# EAGLE design ESP32 (EAGLE 7.0.0)
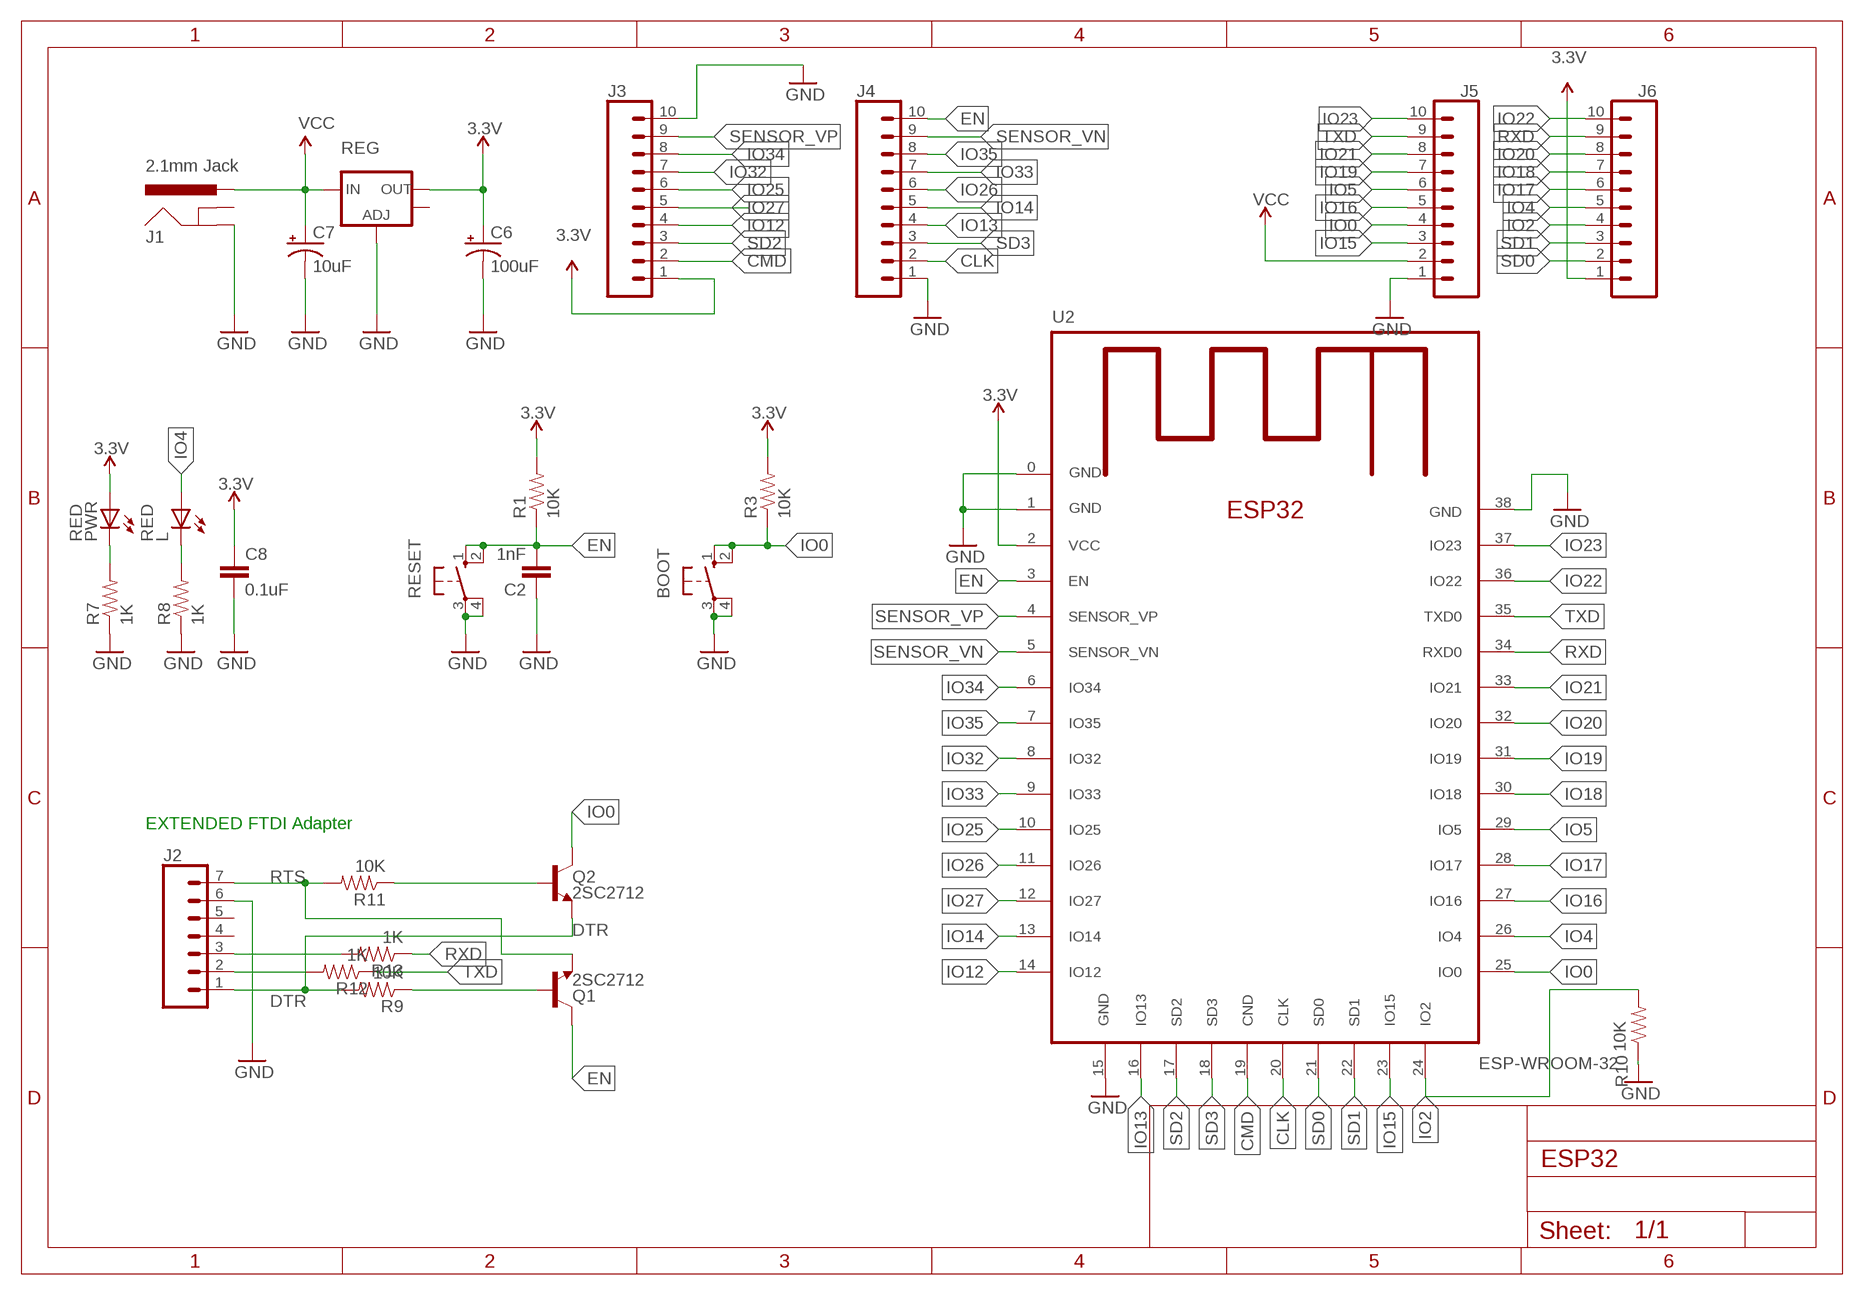
[diagram p0: schematic, sheet 1]

## Parts
BOOT  10-XX  [B3F-10XX]
C2  1nF  CAP0805  [0805]
C6  100uF  CAP_POLD  [PANASONIC_D]
C7  10uF  CAP_POLD  [PANASONIC_D]
C8  0.1uF  CAP0805  [0805]
J1  2.1mm Jack  POWER_JACKPTH_LOCK  [POWER_JACK_PTH_LOCK]
J2  CONN_07LOCK  [1X07_LOCK]
J3  CONN_10"  [1X10]
J4  CONN_10"  [1X10]
J5  CONN_10"  [1X10]
J6  CONN_10"  [1X10]
L  RED  LEDCHIP-LED0805  [CHIP-LED0805]
PWR  RED  LEDCHIP-LED0805  [CHIP-LED0805]
Q1  2SC2712  TRANS_NPN-MMBTA42  [SOT23-3]
Q2  2SC2712  TRANS_NPN-MMBTA42  [SOT23-3]
R1  10K  RESISTOR0805-RES  [0805]
R3  10K  RESISTOR0805-RES  [0805]
R7  1K  RESISTOR0805-RES  [0805]
R8  1K  RESISTOR0805-RES  [0805]
R9  10K  RESISTOR0805-RES  [0805]
R10  10K  RESISTOR0805-RES  [0805]
R11  10K  RESISTOR0805-RES  [0805]
R12  1K  RESISTOR0805-RES  [0805]
R13  1K  RESISTOR0805-RES  [0805]
REG  V_REG_LM1117SOT223  [SOT223]
RESET  10-XX  [B3F-10XX]
U2  ESP-WROOM-32  ESP32MOD  [ESP32MOD]

## Nets
3.3V [PWR]: C6.+ C8.1 J3.1 J6.1 PWR.A R1.2 R3.2 REG.2(OUT) U2.2(VCC)
B: Q2.1(B) R11.1
CLK: J4.2 U2.20(CLK)
CMD: J3.2 U2.19(CND)
DTR: J2.1 Q2.2(E) R9.2
EN: C2.2 J4.10 Q1.3(C) R1.1 RESET.1(S) RESET.2(S1) U2.3(EN)
GND [PWR]: BOOT.3(P) BOOT.4(P1) C2.1 C6.- C7.- C8.2 J1.GND J2.6 J3.10 J4.1 J5.1 R7.1 R8.1 R10.1 REG.1(ADJ) RESET.3(P) RESET.4(P1) U2.15(GND) U2.38(GND)
IO0: BOOT.1(S) BOOT.2(S1) J5.4 Q2.3(C) R3.1 U2.25(IO0)
IO2: J6.4 R10.2 U2.24(IO2)
IO4: J6.5 L.A U2.26(IO4)
IO5: J5.6 U2.29(IO5)
IO12: J3.4 U2.14(IO12)
IO13: J4.4 U2.16(IO13)
IO14: J4.5 U2.13(IO14)
IO15: J5.3 U2.23(IO15)
IO16: J5.5 U2.27(IO16)
IO17: J6.6 U2.28(IO17)
IO18: J6.7 U2.30(IO18)
IO19: J5.7 U2.31(IO19)
IO20: J6.8 U2.32(IO20)
IO21: J5.8 U2.33(IO21)
IO22: J6.10 U2.36(IO22)
IO23: J5.10 U2.37(IO23)
IO25: J3.6 U2.10(IO25)
IO26: J4.6 U2.11(IO26)
IO27: J3.5 U2.12(IO27)
IO32: J3.7 U2.8(IO32)
IO33: J4.7 U2.9(IO33)
IO34: J3.8 U2.6(IO34)
IO35: J4.8 U2.7(IO35)
N$1: J2.2 R12.2
N$2: J2.3 R13.2
N$3: Q1.1(B) R9.1
N$11 [PWR]: PWR.C R7.2
N$12 [PWR]: L.C R8.2
RTS: J2.7 Q1.2(E) R11.2
RXD: J6.9 R13.1 U2.34(RXD0)
SD0: J6.2 U2.21(SD0)
SD1: J6.3 U2.22(SD1)
SD2: J3.3 U2.17(SD2)
SD3: J4.3 U2.18(SD3)
SENSOR_VN: J4.9 U2.5(SENSOR_VN)
SENSOR_VP: J3.9 U2.4(SENSOR_VP)
TXD: J5.9 R12.1 U2.35(TXD0)
VCC [PWR]: C7.+ J1.PWR J5.2 REG.3(IN)
Unconnected: J1.GNDBREAK J2.4 J2.5 REG.4(OUT)

## Notes on the sheet
- EXTENDED FTDI Adapter

## Power pins joined to a net without a drawn wire
GND: U2.0(GND) U2.1(GND)

## Library data of the parts
BOOT RESET = ginger:10-XX: OMRON SWITCH
C2 C8 = SparkFun:CAP: Capacitor Standard 0603 ceramic capacitor, and 0.1" leaded capacitor.
C6 C7 = SparkFun:CAP_POL: Capacitor Polarized These are standard SMD and PTH capacitors. Normally 10uF, 47uF, and 100uF in electrolytic and tantalum varieties. Always verify the external diameter of the through hole cap, it varies with capacity, voltage, and manufacturer. The EIA devices should be standard.
J1 = SparkFun-Connectors:POWER_JACK: Power Jack This is the standard 5.5mm barrel jack for power. The PTH is the most common, proven, reliable, footprint. The Slot footprint only works if the mill layer is transmitted to the PCB fab house so be warned. Spark Fun Electronics SKU : PRT-00119 SMT: CONN-08106 Mating wall wart : TOL-00298 (and others)
J2 = SparkFun-Connectors:CONN_07: Multi connection point. Often used as Generic Header-pin footprint for 0.1 inch spaced/style header connections On any of the 0.1 inch spaced packages, you can populate with these: Break Away Headers - Straight <https://www.sparkfun.com/products/116> (PRT-00116) Break Away Male Headers - Right Angle <https://www.sparkfun.com/products/553> (PRT-00553) Female Headers <https://www.sparkfun.com/products/115> (PRT-00115) Break Away Headers - Machine Pin <https://www.sparkfun.com/products/117> (PRT-00117) Break Away Female Headers - Swiss Machine Pin <https://www.sparkfun.com/products/743> (PRT-00743) For SCREWTERMINALS and SPRING TERMINALS visit here: Screw Terimnals on SparkFun.com <https://www.sparkfun.com/search/results?term=Screw+Terminals> (5mm/3.5mm/2.54mm spacing) This device is also useful as a general connection point to wire up your design to another part of your project. Our various solder wires solder well into these plated through hole pads. Hook-Up Wire - Assortment (Stranded, 22 AWG) <https://www.sparkfun.com/products/11375> (PRT-11375) Hook-Up Wire - Assortment (Solid Core, 22 AWG) <https://www.sparkfun.com/products/11367> (PRT-11367) View the entire wire category on our website here <https://www.sparkfun.com/categories/141> Special notes: Molex polarized connector foot print use with SKU : PRT-08231 with associated crimp pins and housings. 1MM SMD Version SKU: PRT-10208 NOTES ON THE VARIANTS LOCK and LOCK_LONGPADS... This footprint was designed to help hold the alignment of a through-hole component (i.e. 6-pin header) while soldering it into place. You may notice that each hole has been shifted either up or down by 0.005 of an inch from it's more standard position (which is a perfectly straight line). This slight alteration caused the pins (the squares in the middle) to touch the edges of the holes. Because they are alternating, it causes a "brace" to hold the component in place. 0.005 has proven to be the perfect amount of "off-center" position when using our standard breakaway headers. Although looks a little odd when you look at the bare footprint, once you have a header in there, the alteration is very hard to notice. Also,if you push a header all the way into place, it is covered up entirely on the bottom side.
J3-J6 = SparkFun-Connectors:CONN_10: Multi connection point. Often used as Generic Header-pin footprint for 0.1 inch spaced/style header connections On any of the 0.1 inch spaced packages, you can populate with these: Break Away Headers - Straight <https://www.sparkfun.com/products/116> (PRT-00116) Break Away Male Headers - Right Angle <https://www.sparkfun.com/products/553> (PRT-00553) Female Headers <https://www.sparkfun.com/products/115> (PRT-00115) Break Away Headers - Machine Pin <https://www.sparkfun.com/products/117> (PRT-00117) Break Away Female Headers - Swiss Machine Pin <https://www.sparkfun.com/products/743> (PRT-00743) Arduino Stackable Header - 10 Pin <https://www.sparkfun.com/products/11376> (PRT-11376) For SCREWTERMINALS and SPRING TERMINALS visit here: Screw Terimnals on SparkFun.com <https://www.sparkfun.com/search/results?term=Screw+Terminals> (5mm/3.5mm/2.54mm spacing) This device is also useful as a general connection point to wire up your design to another part of your project. Our various solder wires solder well into these plated through hole pads. Hook-Up Wire - Assortment (Stranded, 22 AWG) <https://www.sparkfun.com/products/11375> (PRT-11375) Hook-Up Wire - Assortment (Solid Core, 22 AWG) <https://www.sparkfun.com/products/11367> (PRT-11367) View the entire wire category on our website here <https://www.sparkfun.com/categories/141> Special notes: Molex polarized connector foot print use with SKU : PRT-08231 with associated crimp pins and housings. 1MM SMD Version SKU: PRT-10208 NOTES ON THE VARIANTS LOCK and LOCK_LONGPADS... This footprint was designed to help hold the alignment of a through-hole component (i.e. 6-pin header) while soldering it into place. You may notice that each hole has been shifted either up or down by 0.005 of an inch from it's more standard position (which is a perfectly straight line). This slight alteration caused the pins (the squares in the middle) to touch the edges of the holes. Because they are alternating, it causes a "brace" to hold the component in place. 0.005 has proven to be the perfect amount of "off-center" position when using our standard breakaway headers. Although looks a little odd when you look at the bare footprint, once you have a header in there, the alteration is very hard to notice. Also,if you push a header all the way into place, it is covered up entirely on the bottom side.; PROD_ID: CONN-11563
L PWR = adafruit:LED: LED OSRAM: - CHIPLED LG R971, LG N971, LY N971, LG Q971, LY Q971, LO R971, LY R971 LH N974, LH R974 LS Q976, LO Q976, LY Q976 LO Q996 - Hyper CHIPLED LW Q18S LB Q993, LB Q99A, LB R99A - SideLED LS A670, LO A670, LY A670, LG A670, LP A670 LB A673, LV A673, LT A673, LW A673 LH A674 LY A675 LS A676, LA A676, LO A676, LY A676, LW A676 LS A679, LY A679, LG A679 - Hyper Micro SIDELED® LS Y876, LA Y876, LO Y876, LY Y876 LT Y87S - SmartLED LW L88C, LW L88S LB L89C, LB L89S, LG L890 LS L89K, LO L89K, LY L89K LS L896, LA L896, LO L896, LY L896 - TOPLED LS T670, LO T670, LY T670, LG T670, LP T670 LSG T670, LSP T670, LSY T670, LOP T670, LYG T670 LG T671, LOG T671, LSG T671 LB T673, LV T673, LT T673, LW T673 LH T674 LS T676, LA T676, LO T676, LY T676, LB T676, LH T676, LSB T676, LW T676 LB T67C, LV T67C, LT T67C, LS T67K, LO T67K, LY T67K, LW E67C LS E67B, LA E67B, LO E67B, LY E67B, LB E67C, LV E67C, LT E67C LW T67C LS T679, LY T679, LG T679 LS T770, LO T770, LY T770, LG T770, LP T770 LB T773, LV T773, LT T773, LW T773 LH T774 LS E675, LA E675, LY E675, LS T675 LS T776, LA T776, LO T776, LY T776, LB T776 LHGB T686 LT T68C, LB T68C - Hyper Mini TOPLED® LB M676 - Mini TOPLED Santana® LG M470 LS M47K, LO M47K, LY M47K Source: http://www.osram.convergy.de/
Q1 Q2 = SparkFun-DiscreteSemi:TRANS_NPN: NPN transistor Current controlled devices typically used to amplify current or used as a switch. BC547 - COM-08928 <http://www.sparkfun.com/products/8928> (TO-92 45V 100mA) (1.Collector 2.Base 3.Emitter) 2N3904 - COM-00521 <http://www.sparkfun.com/products/521> (TO-92 40V 200mA) (1.Emitter 2.Base 3.Collector) P2N2222A - COM-12852 <http://www.sparkfun.com/products/12852> (TO-92 40V 600mA) (1.Collector 2.Base 3.Emitter); PROD_ID: TRANS-09116; VALUE: 500mA/300V
R1 R3 R7-R13 = SparkFun:RESISTOR: Resistor Basic schematic elements and footprints for 0603, 1206, and PTH resistors.
REG = SparkFun-PowerIC:V_REG_LM1117: Voltage Regulator LM1117 Standard adjustable voltage regulator but in SMD form. Spark Fun Electronics SKU : COM-00595
U2 = ESP3x:ESP32MOD: ESP32 Module Espressif

## Net classes
0 default: width 0.254 mm
1 PWR: width 0.762 mm

## Board
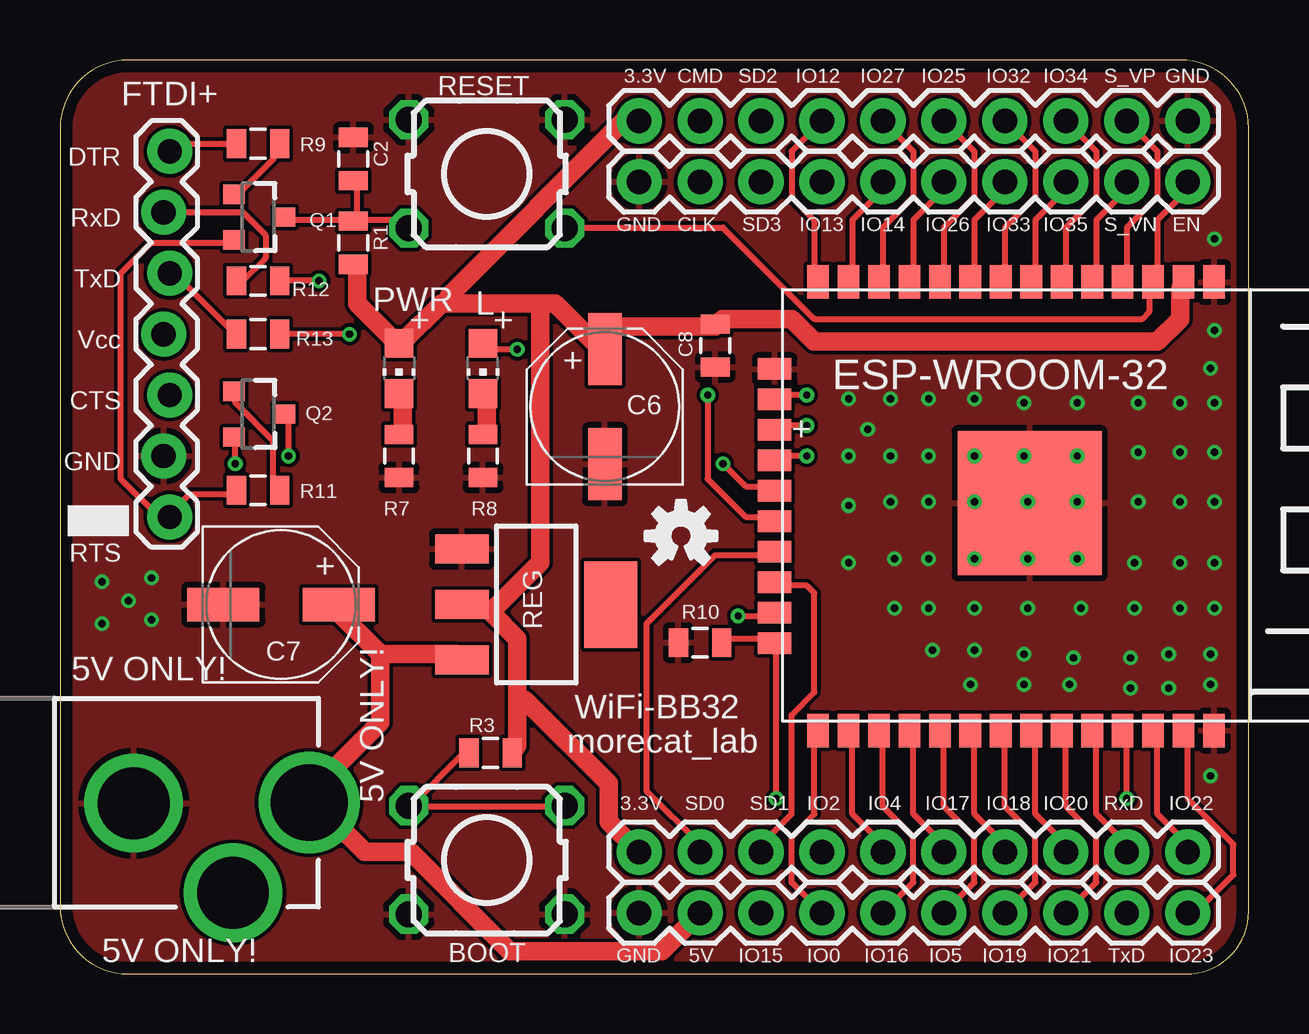
[diagram p1: board, top side]
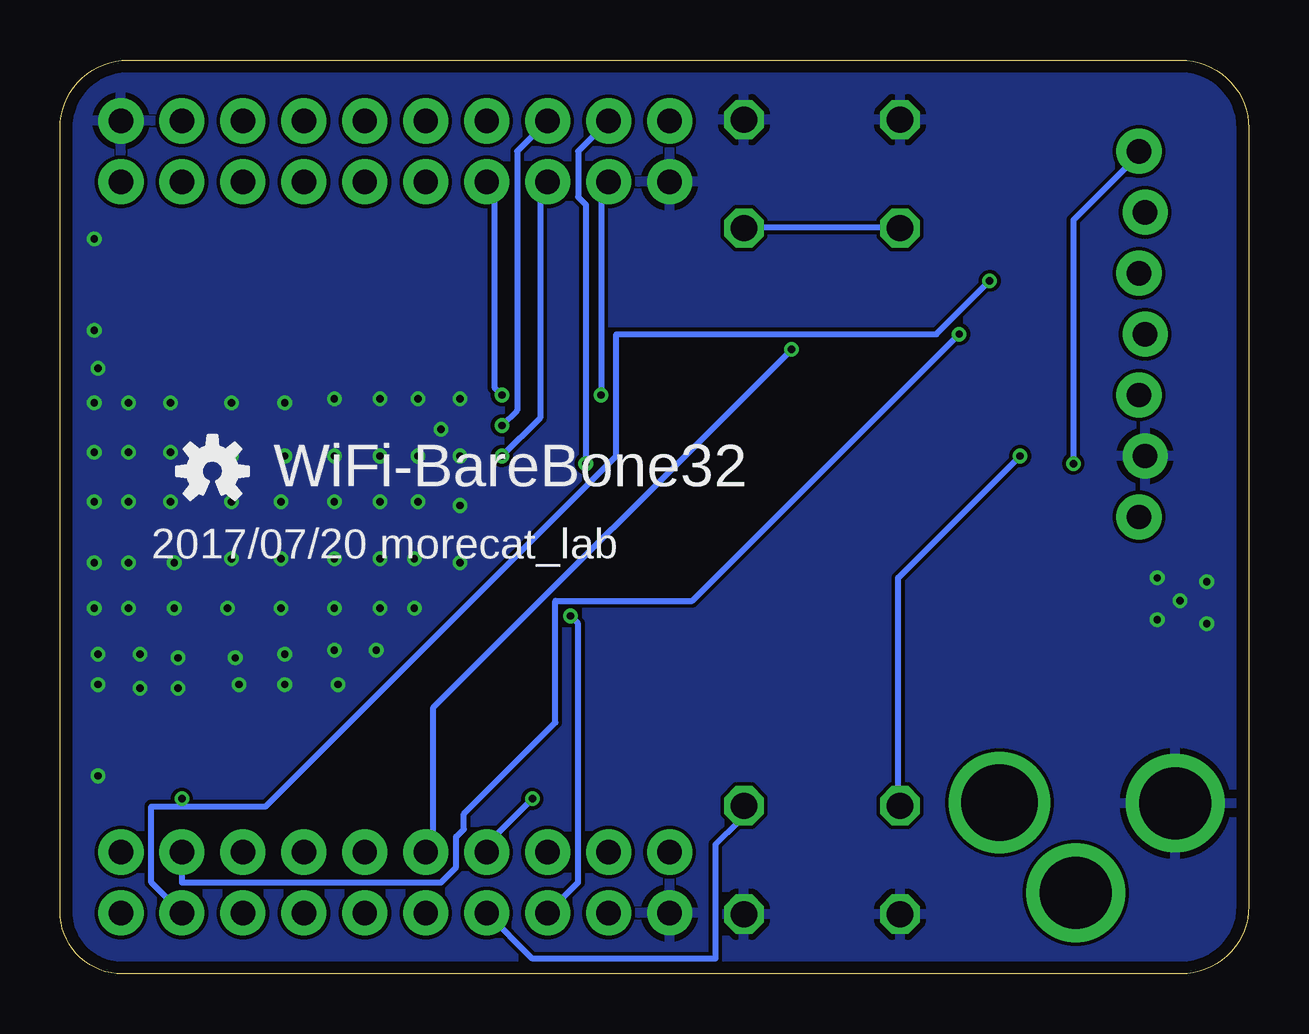
[diagram p2: board, bottom side, seen from below]

Size 49.53 x 38.1 mm. Coordinates in mm from the lower left corner, seen from the top.
Outline: 49.53,2.6 49.53,35.26 arc90 46.69,38.1 2.84,38.1 arc90 0,35.26 0,2.83 arc90 2.83,0 46.93,0 arc90 49.53,2.6
Copper layers (1*2*15*16): Top 0.035mm / dielectric 0.2mm / layer 2 0.035mm / dielectric 1.2mm / layer 15 0.035mm / dielectric 0.2mm / Bottom 0.035mm
Design rules "Elecrow_PCB_eagle_rule": minimum track width 6mil, minimum drill 12mil, track to track 6mil, track to pad 8mil, pad to pad 12mil, via to via 6mil, smd to smd 0mil, copper to edge 20mil, drill to drill 10mil, minimum pad ring 6mil, minimum via ring 6mil, stop-mask expansion 0mil, vias tented up to drill 100mil, thermal gap 10mil

### Footprints (pad centres in the part's own frame; a part is rotated, then mirrored left to right if it is on the bottom)
B3F-10XX = drill 1.092 octagon: 1 -3.251,2.261; 2 3.251,2.261; 3 -3.251,-2.261; 4 3.251,-2.261
0805 = smd 0.8 x 1.2: 1 -0.9,0; 2 0.9,0
PANASONIC_D = smd 3 x 1.4: + 2.4,0; - -2.4,0
POWER_JACK_PTH_LOCK = drill 2.997 pad 4.115: GND 0.025,6.557; GNDBREAK 3.762,10.7 | drill 3.2 pad 4.115: PWR 0,13.878
1X07_LOCK = drill 1.016 pad 1.88: 1 0,0.127; 2 2.54,-0.127; 3 5.08,0.127; 4 7.62,-0.127; 5 10.16,0.127; 6 12.7,-0.127; 7 15.24,0.127
1X10 = drill 1.016 pad 1.88: 1 0,0; 2 2.54,0; 3 5.08,0; 4 7.62,0; 5 10.16,0; 6 12.7,0; 7 15.24,0; 8 17.78,0; 9 20.32,0; 10 22.86,0
CHIP-LED0805 = smd 1.2 x 1.2: A 0,-1.05; C 0,1.05
SOT23-3 = smd 0.8 x 0.9: 1 -0.95,-1; 2 0.95,-1; 3 0,1.1
SOT223 = smd 1.219 x 2.235: 1 -2.311,-3.099; 2 0,-3.099; 3 2.311,-3.099 | smd 3.6 x 2.2: 4 0,3.099
ESP32MOD = smd 6 x 6: 0 9.9,12.3 | smd 1.4 x 0.9: 1 0.68,19.99; 2 0.68,18.72; 3 0.68,17.45; 4 0.68,16.18; 5 0.68,14.91; 6 0.68,13.64; 7 0.68,12.37; 8 0.68,11.1; 9 0.68,9.83; 10 0.68,8.56; 11 0.68,7.29; 12 0.68,6.02; 13 0.68,4.75; 14 0.68,3.48; 25 19.38,3.48; 26 19.38,4.75; 27 19.38,6.02; 28 19.38,7.29; 29 19.38,8.56; 30 19.38,9.83; 31 19.38,11.1; 32 19.38,12.37; 33 19.38,13.64; 34 19.38,14.91; 35 19.38,16.18; 36 19.38,17.45; 37 19.38,18.72; 38 19.38,19.99 | smd 0.9 x 1.4: 15 4.31,1.68; 16 5.58,1.68; 17 6.85,1.68; 18 8.12,1.68; 19 9.39,1.68; 20 10.66,1.68; 21 11.93,1.68; 22 13.2,1.68; 23 14.47,1.68; 24 15.74,1.68

### Placement (x,y rotation side)
BOOT  17.78,4.75 0 top
C2  12.22,33.97 270 top
C6  22.7,23.65 90 top
C7  9.21,15.4 0 top
C8  27.3,26.19 270 top
J1  -3.49,7.14 270 top
J2  4.45,34.29 270 top
J3  24.13,35.56 0 top
J4  24.13,33.02 0 top
J5  24.13,2.54 0 top
J6  24.13,5.08 0 top
L  17.62,25.24 180 top
PWR  14.13,25.24 180 top
Q1  8.26,31.55 270 top
Q2  8.26,23.34 270 top
R1  12.22,30.48 270 top
R3  17.94,9.22 0 top
R7  14.13,21.59 90 top
R8  17.62,21.59 90 top
R9  8.26,34.61 180 top
R10  26.67,13.81 0 top
R11  8.26,20.16 180 top
R12  8.26,28.89 180 top
R13  8.26,26.67 180 top
REG  19.84,15.4 270 top
RESET  17.78,33.35 180 top
U2  28.1,29.53 270 top
U$2  [OSHW-LOGO-S]  25.88,18.26 0 top
U$3  [OSHW-LOGO-S]  43.18,20.95 0 bottom

### Tracks (layer width: path | path; a pad name or v marks a point on that pad's centre or on a via)
3.3V
  Top 0.762: 19.05,11.43 19.05,13.97 17.94,15.08 | 19.05,11.43 19.05,9.53 R3.2 | 17.94,15.08 17.78,15.24 16.83,15.24 REG.2 | J6.1 22.86,6.35 22.86,7.94 19.37,11.43 19.05,11.43 | R1.2 12.38,29.53 12.38,27.94 13.97,26.35 PWR.A 14.29,26.35 15.88,27.94 16.19,27.94 | U2.2 46.67,28.57 46.67,27.3 45.72,26.35 31.43,26.35 30.48,27.3 27.62,27.3 C8.1 27.3,26.99 23.18,26.99 22.54,26.35 C6.+ 22.23,26.35 20.64,27.94 20,27.94 | 20,27.94 16.19,27.94 | J3.1 23.5,35.56 16.19,28.26 16.19,27.94 | 17.94,15.08 20,17.14 20,27.94
B
  Top 0.254: Q2.1 7.3,24.13 7.3,23.81 8.89,22.23 8.89,20.32 R11.1
CLK  (via drill 0.3)
  Top 0.254: v26.99,24.13 26.99,20.64 28.57,19.05 29.53,19.05 U2.20
  Bottom 0.254: v26.99,24.13 26.99,32.7 J4.2
CMD  (via drill 0.3)
  Top 0.254: v27.62,21.27 28.57,20.32 29.53,20.32 U2.19
  Bottom 0.254: v27.62,21.27 27.62,32.07 27.94,32.38 27.94,34.29 J3.2
DTR  (via drill 0.3)
  Top 0.254: v7.3,21.27 7.3,22.23 Q2.2 | R9.2 5.08,34.61 4.76,34.29 J2.1
  Bottom 0.254: v7.3,21.27 7.3,31.43 4.76,33.97 4.76,34.29 J2.1
EN
  Top 0.254: J4.10 46.99,32.7 45.72,31.43 45.72,28.89 U2.3 45.4,28.57 45.4,27.62 45.09,27.3 31.43,27.3 27.62,31.11 21.27,31.11 RESET.1 | Q1.3 9.53,31.43 12.06,31.43 R1.1 12.38,31.43 | 12.38,31.43 12.38,33.02 C2.2 | 12.38,31.43 13.97,31.43 14.29,31.11 RESET.2
  Bottom 0.254: RESET.1 20.95,31.11 14.61,31.11 RESET.2
GND  (via drill 0.3)
  other vias: 38.1,21.59 38.1,17.3 42.39,17.3 42.39,21.59 38.1,19.68 42.39,19.68 40.32,19.68 40.16,21.59 40.32,17.3 36.2,21.59 36.2,19.68 36.2,17.3 44.93,19.68 44.93,21.75 44.77,17.14 40.32,15.24 42.55,15.24 38.1,15.24 44.77,15.24 36.2,15.24 44.93,23.81 42.39,23.81 40.16,23.81 38.1,23.97 36.2,23.97 46.67,17.14 46.67,15.24 46.67,19.68 46.67,21.75 46.67,23.81 48.1,23.81 48.1,21.75 48.1,19.68 48.1,17.14 48.1,15.24 34.77,15.24 34.77,17.3 34.61,19.68 34.61,21.59 34.61,23.97 32.86,23.97 32.86,21.59 33.66,22.7 32.86,19.53 32.86,17.14 36.35,13.49 38.1,13.49 40.16,13.34 44.61,13.18 42.23,13.18 46.2,13.34 47.94,13.34 47.94,12.06 48.1,26.83 47.94,25.24 44.61,11.91 42.07,12.06 40.16,12.06 37.94,12.06 46.2,11.91 48.1,30.64 47.94,8.26 3.81,16.51 3.81,14.76 1.75,16.35 1.75,14.61 2.86,15.56
  pour Bottom: 0,40.64 0,0 50.8,0 50.8,40.64
  pour Top: 0,0 50.8,0 50.8,40.64 0,40.64
IO0  (via drill 0.3)
  Top 0.254: J5.4 30.48,3.81 30.48,5.71 31.43,6.67 31.43,9.84 U2.25 | v9.53,21.59 9.53,23.18 Q2.3 | 14.61,6.99 16.83,9.21 R3.1 | 14.61,6.99 20.95,6.99 BOOT.2 | 14.61,6.99 BOOT.1
  Bottom 0.254: v9.53,21.59 14.61,16.51 14.61,7.3 BOOT.1 | J5.4 29.84,0.64 22.23,0.64 22.23,5.4 21.27,6.35 21.27,6.99 BOOT.2
IO2  (via drill 0.3)
  Top 0.254: R10.2 27.62,13.97 29.53,13.97 U2.24 29.84,13.65 v29.84,7.3
  Bottom 0.254: v29.84,7.3 31.75,5.4 J6.4
IO4  (via drill 0.3)
  Top 0.254: v19.05,26.04 17.78,26.04 L.A | J6.5 34.29,5.4 33.02,6.67 33.02,9.84 U2.26
  Bottom 0.254: v19.05,26.04 33.97,11.11 33.97,5.4 J6.5
IO5
  Top 0.254: J5.6 38.1,3.81 38.1,5.71 36.83,6.99 36.83,9.84 U2.29
IO12
  Top 0.254: J3.4 30.48,34.29 30.48,32.38 31.43,31.43 31.43,28.89 U2.14
IO13  (via drill 0.3)
  Top 0.254: v31.11,24.13 29.84,24.13 U2.16
  Bottom 0.254: v31.11,24.13 31.43,24.45 31.43,32.7 J4.4
IO14
  Top 0.254: J4.5 34.29,32.7 33.02,31.43 33.02,28.89 U2.13
IO15  (via drill 0.3)
  Top 0.254: v28.26,14.92 29.53,14.92 U2.23
  Bottom 0.254: v28.26,14.92 27.94,14.61 27.94,3.81 J5.3
IO16
  Top 0.254: J5.5 35.56,3.81 35.56,5.71 34.29,6.99 34.29,9.84 U2.27
IO17
  Top 0.254: J6.6 36.83,5.4 35.56,6.67 35.56,9.84 U2.28
IO18
  Top 0.254: J6.7 39.37,5.4 38.1,6.67 38.1,9.84 U2.30
IO19
  Top 0.254: J5.7 40.64,3.81 40.64,5.71 39.37,6.99 39.37,9.84 U2.31
IO20
  Top 0.254: J6.8 41.91,5.4 40.64,6.67 40.64,9.84 U2.32
IO21
  Top 0.254: J5.8 43.18,3.81 43.18,5.71 41.91,6.99 41.91,9.84 U2.33
IO22
  Top 0.254: J6.10 46.99,5.4 45.72,6.67 45.72,9.84 U2.36
IO23
  Top 0.254: J5.10 47.31,2.54 48.9,4.13 48.9,5.4 46.99,7.3 46.99,9.84 U2.37
IO25
  Top 0.254: J3.6 38.1,34.29 38.1,32.38 36.83,31.11 36.83,28.89 U2.10
IO26
  Top 0.254: J4.6 36.83,32.7 35.56,31.43 35.56,28.89 U2.11
IO27
  Top 0.254: J3.5 35.56,34.29 35.56,32.38 34.29,31.11 34.29,28.89 U2.12
IO32
  Top 0.254: J3.7 40.64,34.29 40.64,32.38 39.37,31.11 39.37,28.89 U2.8
IO33
  Top 0.254: J4.7 39.37,32.7 38.1,31.43 38.1,28.89 U2.9
IO34
  Top 0.254: J3.8 43.18,34.29 43.18,32.38 41.91,31.11 41.91,28.89 U2.6
IO35
  Top 0.254: J4.8 41.91,32.7 40.64,31.43 40.64,28.89 U2.7
N$1
  Top 0.254: J2.2 7.62,31.75 8.57,30.8 8.57,29.84 7.62,28.89 R12.2
N$2
  Top 0.254: R13.2 7.3,26.67 4.76,29.21 J2.3
N$3
  Top 0.254: Q1.1 7.3,32.7 7.62,32.7 8.89,33.97 8.89,34.61 R9.1
N$11
  Top 0.762: R7.2 14.29,22.54 14.29,24.13 PWR.C
N$12
  Top 0.762: R8.2 17.78,22.54 17.78,24.13 L.C
RTS
  Top 0.254: 4.45,19.05 4.13,19.05 2.54,20.64 2.54,29.21 3.81,30.48 6.99,30.48 Q1.2 | 4.45,19.05 5.4,20 7.3,20 R11.2 | 4.45,19.05 J2.7
RXD  (via drill 0.3)
  Top 0.254: v12.06,26.67 R13.1 | J6.9 44.45,5.4 43.18,6.67 43.18,9.84 U2.34
  Bottom 0.254: v12.06,26.67 23.18,15.56 28.89,15.56 28.89,10.48 32.7,6.67 32.7,6.03 33.02,5.71 33.02,4.45 33.66,3.81 44.45,3.81 J6.9
SD0
  Top 0.254: J6.2 26.67,5.4 24.45,7.62 24.45,14.61 27.3,17.46 29.53,17.46 U2.21
SD1
  Top 0.254: J6.3 29.21,5.4 30.48,6.67 30.48,10.79 31.43,11.75 31.43,15.88 31.11,16.19 29.84,16.19 U2.22
SD2  (via drill 0.3)
  Top 0.254: v31.11,22.86 29.84,22.86 U2.17
  Bottom 0.254: v31.11,22.86 30.48,23.5 30.48,34.29 J3.3
SD3  (via drill 0.3)
  Top 0.254: v31.11,21.59 29.84,21.59 U2.18
  Bottom 0.254: v31.11,21.59 29.53,23.18 29.53,32.7 J4.3
SENSOR_VN
  Top 0.254: J4.9 44.45,32.7 43.18,31.43 43.18,28.89 U2.5
SENSOR_VP
  Top 0.254: J3.9 45.72,34.29 45.72,32.38 44.45,31.11 44.45,28.89 U2.4
TXD  (via drill 0.3)
  Top 0.254: v10.79,28.89 R12.1 | v44.45,7.3 44.45,9.84 U2.35
  Bottom 0.254: v10.79,28.89 13.02,26.67 26.35,26.67 26.35,21.59 40.96,6.99 44.45,6.99 | 44.45,6.99 45.72,6.99 45.72,3.81 J5.9 | 44.45,6.99 v44.45,7.3
VCC
  Top 0.762: 13.34,13.34 16.51,13.34 REG.3 | 13.34,13.34 11.43,15.24 C7.+ | J5.2 25.08,0.95 18.73,0.95 14.61,5.08 12.7,5.08 10.48,7.3 J1.PWR 10.48,7.62 13.34,10.48 13.34,13.34

### Text on the board
tNames: 3.3V | CMD | SD2 | IO12 | IO27 | IO25 | IO32 | IO34 | S_VP | GND | FTDI+ | DTR | RxD | GND | CLK | SD3 | IO13 | IO14 | IO26 | IO33 | IO35 | S_VN | EN | TxD | Vcc | + | CTS | GND | + | RTS | + | 5V ONLY! | WiFi-BB32 | morecat_lab | 5V ONLY! | 3.3V | SD0 | SD1 | IO2 | IO4 | IO17 | IO18 | IO20 | RxD | IO22 | 5V ONLY! | GND | 5V | IO15 | IO0 | IO16 | IO5 | IO19 | IO21 | TxD | IO23
bNames: WiFi-BareBone32 | 2017/07/20 morecat_lab